# Altium schematic sheet LDO3V.SchDoc
size A4; DocumentNumber: 3; SheetNumber: 3; SheetTotal: 8
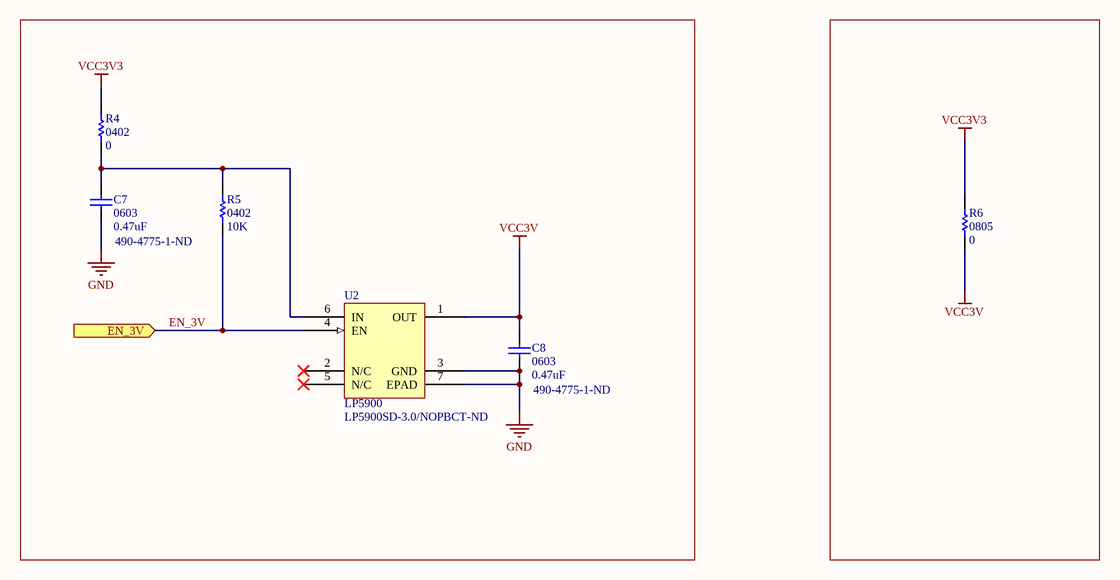
[diagram p0: LDO3V.SchDoc]

## Parts
C7  0603  value 0.47uF  Supplier Part Number 1: 490-4775-1-ND  [RAD-0.3]
C8  0603  value 0.47uF  Supplier Part Number 1: 490-4775-1-ND  [RAD-0.3]
R4  0402  value 0  [AXIAL-0.3]
R5  0402  value 10K  [AXIAL-0.3]
R6  0805  value 0  [AXIAL-0.3]
U2  LP5900  Supplier Part Number 1: LP5900SD-3.0/NOPBCT-ND  [DFN220X250X80-7]

## Ports
EN_3V (in)

## Nets
GND: C7.1 C8.1 U2.3(GND) U2.7(EPAD)
VCC3V: C8.2 R6.1 U2.1(OUT)
VCC3V3: R4.2 R6.2
EN_3V: R5.1 U2.4(EN) ; port EN_3V
NetC7_2: C7.2 R4.1 R5.2 U2.6(IN)

Not connected (* = marked no-connect by the designer): U2 2(N/C)* 5(N/C)*

## Library data of the parts
C7 C8 = Cap: Capacitor; Manufacturer: Murata; Manufacturer Part Number: GCM188R71C474KA55D; Capacitance: 470nF; Voltage Rating: 16V; Tolerance: 10%; Dielectric: X7R; Published: 8-Jun-2000; LatestRevisionDate: 17-Jul-2002; LatestRevisionNote: Re-released for DXP Platform.; PackageReference: RAD-0.3; Publisher: Altium Limited; PackageDescription: Radial Cap, Thru-Hole; 2 Leads; 0.3 in Pin Spacing; Supplier 1: Digi-Key; Stock 1: 955499; Pricing 1: 1=0.28, 10=0.193, 100=0.098, 500=0.06706, 1000=0.05933 (USD); Mount: Surface Mount; Case/Package: 0603; Case Code (Imperial): 0603; Case Code (Metric): 1608; Min Operating Temperature: -55°C; Max Operating Temperature: 125°C; Voltage Rating (DC): 16V; Packaging: Tape and Reel; Package Quantity: 1; Termination: SMD/SMT; Voltage: 16V; Length: 1.6mm; Height: 0.8mm; Width: 0.8mm; Thickness: 0.035inch; Depth: 0.8mm; Ratings: AEC-Q200; Radiation Hardening: No; REACH SVHC: No SVHC; Lead Free: Lead Free; ComponentLink1URL: http://search.murata.co.jp/Ceramy/image/img/A01X/partnumbering_e_02.pdf?src-supplier=Digi-Key; ComponentLink1Description: http://search.murata.co.jp/Ceramy/image/img/A01X/partnumbering_e_02.pdf?src-supplier=Digi-Key; ComponentLink2URL: http://uk.rs-online.com/webdocs/0ef9/0900766b80ef92d0.pdf?src-supplier=RSComponents; ComponentLink2Description: http://uk.rs-online.com/webdocs/0ef9/0900766b80ef92d0.pdf?src-supplier=RSComponents; ComponentLink3URL: https://www.verical.com/server-webapp/html/getDatasheet?partID=223885&src-supplier=Verical; ComponentLink3Description: https://www.verical.com/server-webapp/html/getDatasheet?partID=223885&src-supplier=Verical; ComponentLink4URL: http://search.murata.co.jp/Ceramy/image/img/w_hinm/S0717E.pdf?src-supplier=Future+Electronics; ComponentLink4Description: http://search.murata.co.jp/Ceramy/image/img/w_hinm/S0717E.pdf?src-supplier=Future+Electronics; ComponentLink5URL: http://psearch.murata.com/capacitor/product/GCM188R71C474KA55%23.pdf?src-supplier=Avnet; ComponentLink5Description: http://psearch.murata.com/capacitor/product/GCM188R71C474KA55%23.pdf?src-supplier=Avnet; ComponentLink6URL: http://psearch.murata.com/capacitor/product/GCM188R71C474KA55%23.pdf?src-supplier=Avnet+Europe; ComponentLink6Description: http://psearch.murata.com/capacitor/product/GCM188R71C474KA55%23.pdf?src-supplier=Avnet+Europe
R4-R6 = Res1: Resistor; Published: 8-Jun-2000; LatestRevisionDate: 17-Jul-2002; LatestRevisionNote: Re-released for DXP Platform.; PackageReference: AXIAL-0.3; Publisher: Altium Limited; PackageDescription: Axial Device, Thru-Hole; 2 Leads; 0.3 in Pin Spacing
U2 = LP5900: Low noise 3V low dropout regulator for analog and RF applications.; Supplier 1: Digi-Key